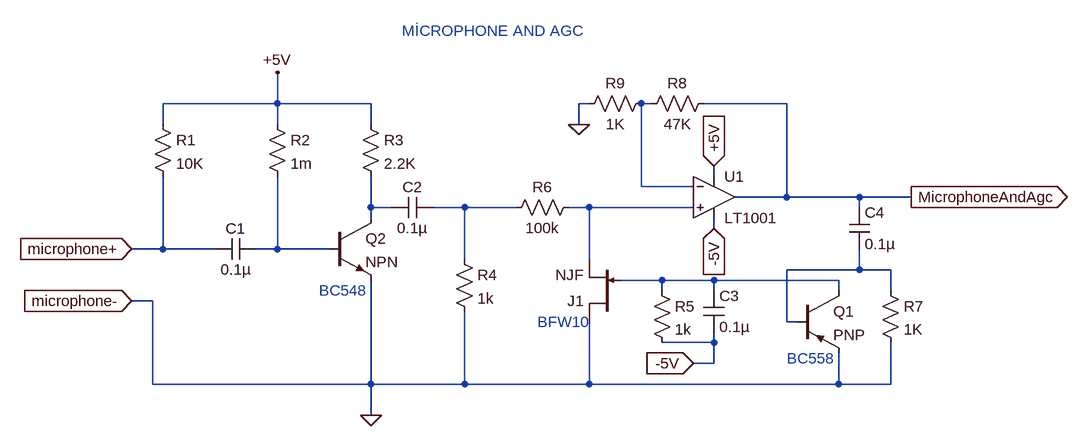
[diagram p0: schematic Draft1.asc]
Draft1.asc, the LTspice schematic file:
Version 4
SHEET 1 1148 680
WIRE -192 -240 -192 -288
WIRE -192 -240 -368 -240
WIRE -48 -240 -192 -240
WIRE 288 -240 272 -240
WIRE 384 -240 368 -240
WIRE 592 -240 464 -240
WIRE -368 -208 -368 -240
WIRE -192 -208 -192 -240
WIRE -48 -208 -48 -240
WIRE 272 -208 272 -240
WIRE 480 -128 480 -144
WIRE 368 -112 368 -240
WIRE 448 -112 368 -112
WIRE 592 -96 592 -240
WIRE 592 -96 512 -96
WIRE 704 -96 592 -96
WIRE 784 -96 704 -96
WIRE -48 -80 -48 -128
WIRE -16 -80 -48 -80
WIRE 96 -80 48 -80
WIRE 176 -80 96 -80
WIRE 288 -80 256 -80
WIRE 448 -80 288 -80
WIRE 704 -80 704 -96
WIRE -48 -64 -48 -80
WIRE 480 -48 480 -64
WIRE -368 -16 -368 -128
WIRE -368 -16 -416 -16
WIRE -288 -16 -368 -16
WIRE -192 -16 -192 -128
WIRE -192 -16 -224 -16
WIRE -112 -16 -192 -16
WIRE 96 0 96 -80
WIRE 288 0 288 -80
WIRE 704 16 704 -16
WIRE 704 16 592 16
WIRE 752 16 704 16
WIRE 400 32 336 32
WIRE 480 32 400 32
WIRE 672 32 480 32
WIRE 400 48 400 32
WIRE 480 48 480 32
WIRE 672 48 672 32
WIRE 752 48 752 16
WIRE -384 64 -416 64
WIRE 592 96 592 16
WIRE 608 96 592 96
WIRE 480 128 480 112
WIRE 480 128 400 128
WIRE 480 160 480 128
WIRE 480 160 448 160
WIRE -384 192 -384 64
WIRE -48 192 -48 32
WIRE -48 192 -384 192
WIRE 96 192 96 80
WIRE 96 192 -48 192
WIRE 288 192 288 96
WIRE 288 192 96 192
WIRE 672 192 672 144
WIRE 672 192 288 192
WIRE 752 192 752 128
WIRE 752 192 672 192
WIRE -48 240 -48 192
FLAG -416 -16 microphone+
IOPIN -416 -16 In
FLAG -48 240 0
FLAG 448 160 -5V
IOPIN 448 160 In
FLAG 272 -208 0
FLAG 480 -48 -5V
IOPIN 480 -48 In
FLAG 480 -144 +5V
IOPIN 480 -144 In
FLAG 784 -96 MicrophoneAndAgc
IOPIN 784 -96 Out
FLAG -416 64 microphone-
IOPIN -416 64 In
FLAG -192 -288 +5V
SYMBOL res -384 -224 R0
SYMATTR InstName R1
SYMATTR Value 10K
SYMBOL cap -224 -32 R90
WINDOW 0 0 32 VBottom 2
WINDOW 3 32 32 VTop 2
SYMATTR InstName C1
SYMATTR Value 0.1µ
SYMBOL res -208 -224 R0
SYMATTR InstName R2
SYMATTR Value 1m
SYMBOL res -64 -224 R0
SYMATTR InstName R3
SYMATTR Value 2.2K
SYMBOL npn -112 -64 R0
SYMATTR InstName Q2
SYMBOL cap 48 -96 R90
WINDOW 0 0 32 VBottom 2
WINDOW 3 32 32 VTop 2
SYMATTR InstName C2
SYMATTR Value 0.1µ
SYMBOL res 80 -16 R0
SYMATTR InstName R4
SYMATTR Value 1k
SYMBOL res 272 -96 R90
WINDOW 0 0 56 VBottom 2
WINDOW 3 32 56 VTop 2
SYMATTR InstName R6
SYMATTR Value 100k
SYMBOL njf 336 96 R180
SYMATTR InstName J1
SYMBOL res 384 32 R0
SYMATTR InstName R5
SYMATTR Value 1k
SYMBOL cap 464 48 R0
SYMATTR InstName C3
SYMATTR Value 0.1µ
SYMBOL pnp 608 48 R0
SYMATTR InstName Q1
SYMBOL res 736 32 R0
SYMATTR InstName R7
SYMATTR Value 1K
SYMBOL cap 688 -80 R0
SYMATTR InstName C4
SYMATTR Value 0.1µ
SYMBOL Opamps\\LT1001 480 -160 R0
SYMATTR InstName U1
SYMBOL res 480 -256 R90
WINDOW 0 0 56 VBottom 2
WINDOW 3 32 56 VTop 2
SYMATTR InstName R8
SYMATTR Value 47K
SYMBOL res 384 -256 R90
WINDOW 0 0 56 VBottom 2
WINDOW 3 32 56 VTop 2
SYMATTR InstName R9
SYMATTR Value 1K
TEXT 0 -352 Left 2 ;MİCROPHONE AND AGC
TEXT -128 48 Left 2 ;BC548
TEXT 208 96 Left 2 ;BFW10
TEXT 592 152 Left 2 ;BC558

The netlist it stands for:
* Draft1.asc
R1 +5V microphone+ 10K
C1 N005 microphone+ 0.1µ
R2 +5V N005 1m
R3 +5V N002 2.2K
Q2 N002 N005 0 0 NPN
C2 N003 N002 0.1µ
R4 N003 0 1k
R6 N004 N003 100k
J1 0 N007 N004 NJF
R5 N007 -5V 1k
C3 N007 -5V 0.1µ
Q1 N007 N006 0 0 PNP
R7 N006 0 1K
C4 MicrophoneAndAgc N006 0.1µ
XU1 N004 N001 +5V -5V MicrophoneAndAgc LT1001  ; pins In+ In- V+ V- OUT
R8 MicrophoneAndAgc N001 47K
R9 N001 0 1K
.model NPN NPN
.model PNP PNP
.lib standard.bjt
.model NJF NJF
.model PJF PJF
.lib standard.jft
* MİCROPHONE AND AGC
* BC548
* BFW10
* BC558
.lib LTC.lib
.backanno
.end